# Altium schematic sheet 05_LEDs.SchDoc: ECE315 LEDs
size A; Date: 01/08/2018; ApprovedBy: JSK; CheckedBy: JSK; Author: JSK; CompanyName: University of Wisconsin; DrawnBy: JSK; Engineer: JSK; Organization: ECE 315; Address1: College of Engineering; Address2: 1415 Engineering Drive; Address3: Madison, WI 53706; Address4: ECE 315 Spring 2018; Revision: A; SheetNumber: 5; SheetTotal: 6; AssemblyNumber: ECE315-S18; ApprovedDate: ECE315-S18
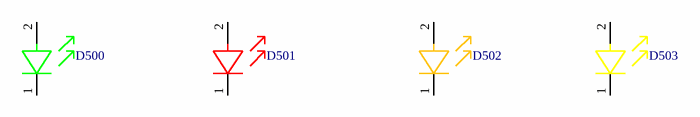
[diagram p0: 05_LEDs.SchDoc]

## Parts
D500  LED_GREEN_0805.1  [LED_GRN_0805]  (value not drawn)
D501  LED_RED_0805.1  [LED_RED_0805]  (value not drawn)
D502  LED_ORANGE.0805.1  [LED_ORG_0805]  (value not drawn)
D503  LED_YELLOW_0805.1  [LED_YEL_0805]  (value not drawn)

## Nets

Not connected (* = marked no-connect by the designer): D500 1(Cathode) 2(Anode); D501 1(Cathode) 2(Anode); D502 1(Cathode) 2(Anode); D503 1(Cathode) 2(Anode)

## Notes on the sheet
- Title:
- Size:
- A
- Machine:
- P.C. Board No:
- Assembly No:
- Rev:
- Sheet:
- of
- College of Engineering
- 1415 Engineering Drive
- Madison, WI 53706

## Library data of the parts
D500 = LED_GREEN_0805.1: LED GREEN CLEAR THIN 0805 SMD; Manufacturer: Vishay / Lite-On; Manufacturer Part Number: LTST-C171KGKT; Chip Material: AlGaInP; DELETED: Compliant; Emitting Color: Yellow Green; Forward Voltage: 2.4 V; Forward Current: 30 mA; Dominant Wave Length: 571 nm; Lum Intensity: 35mcd; High Brightness: Yes; Number of  Elements: 1; Main Category: Chip LED; Power Dissipation: 75 W; Peak Wavelength: 574 nm; Shape Type: Rectangular; Type: Uni-Color; Reverse Voltage: 5 V; Viewing Angle: 130 deg; Test Current (It): 20 mA; Rad Hardened: No; Product Depth (mm): 1.25 mm; Product Height (mm): 0.8 mm; Product Length (mm): 2 mm; Supplier 1: Digi-Key; Stock 1: 322411; Pricing 1: 1=0.31, 10=0.225, 25=0.1656, 100=0.1183, 250=0.0804, 500=0.071, 1000=0.0556 (USD); Mounting: Surface Mount; Operating Temp Range: -55C to 85C; Lens Dimensions: 1.4x1.25x0.5 mm; Luminous Intensity: 35mcd; Package Type: Chip Led; Packaging: Tape and Reel; Pin Count: 2; Operating Temperature Classification: Industrial; ComponentLink1URL: https://datasheet.ciiva.com/15118/getdatasheetpartid-214542-15118099.pdf; ComponentLink1Description: https://datasheet.ciiva.com/15118/getdatasheetpartid-214542-15118099.pdf; ComponentLink2URL: https://datasheet.ciiva.com/16200/lite-on20ltst-c171kgkt-16200100.pdf; ComponentLink2Description: https://datasheet.ciiva.com/16200/lite-on20ltst-c171kgkt-16200100.pdf; ComponentLink3URL: https://datasheet.ciiva.com/2110/s-110-ltst-c171kgkt-2110072.pdf; ComponentLink3Description: https://datasheet.ciiva.com/2110/s-110-ltst-c171kgkt-2110072.pdf; ComponentLink4URL: https://datasheet.ciiva.com/2110/s-110-ltst-c171kgkt-2110073.pdf; ComponentLink4Description: https://datasheet.ciiva.com/2110/s-110-ltst-c171kgkt-2110073.pdf; ComponentLink5URL: https://datasheet.ciiva.com/11774/0900766b80dc0298-11774377.pdf; ComponentLink5Description: https://datasheet.ciiva.com/11774/0900766b80dc0298-11774377.pdf; ComponentLink6URL: https://datasheet.ciiva.com/2110/s-110-ltst-c171kgkt-2110074.pdf; ComponentLink6Description: https://datasheet.ciiva.com/2110/s-110-ltst-c171kgkt-2110074.pdf; ComponentLink7URL: https://datasheet.ciiva.com/12400/lite-on-ltst-c171kgkt-187692-12400799.pdf; ComponentLink7Description: https://datasheet.ciiva.com/12400/lite-on-ltst-c171kgkt-187692-12400799.pdf; Supplier Part Number 1: 160-1426-1-ND
D501 = LED_RED_0805.1: LED SUPER RED CLR THIN 0805 SMD; Manufacturer: Vishay / Lite-On; Manufacturer Part Number: LTST-C171KRKT; Chip Material: AlGaInP; DELETED: Compliant; Dominant Wave Length: 631 nm; Forward Current: 30 mA; Forward Voltage: 2.4 V; High Brightness: Yes; Lum Intensity: 54mcd; Main Category: Chip LED; Number of  Elements: 1; Peak Wavelength: 639 nm; Power Dissipation: 75 W; Product Depth (mm): 1.25 mm; Product Height (mm): 0.8 mm; Product Length (mm): 2 mm; Rad Hardened: No; Reverse Voltage: 5 V; Shape Type: Rectangular; Test Current (It): 20 mA; Type: Uni-Color; Viewing Angle: 130 deg; Supplier 1: Digikey; Stock 1: 97347; Pricing 1: 1=0.31, 10=0.225, 25=0.1656, 100=0.1183, 250=0.0804, 500=0.071, 1000=0.0556 (USD); Emitting Color: Red; Lens Dimensions: 1.4x1.25x0.5 mm; Luminous Intensity: 54mcd; Mounting: Surface Mount; Operating Temp Range: -55C to 85C; Operating Temperature Classification: Industrial; Package Type: Chip Led; Packaging: Tape and Reel; Pin Count: 2; ComponentLink1URL: https://datasheet.ciiva.com/2110/s-110-ltst-c171krkt-2110066.pdf; ComponentLink1Description: https://datasheet.ciiva.com/2110/s-110-ltst-c171krkt-2110066.pdf; ComponentLink2URL: https://datasheet.ciiva.com/2110/s-110-ltst-c171krkt-2110067.pdf; ComponentLink2Description: https://datasheet.ciiva.com/2110/s-110-ltst-c171krkt-2110067.pdf; ComponentLink3URL: https://datasheet.ciiva.com/2110/s-110-ltst-c171krkt-2110068.pdf; ComponentLink3Description: https://datasheet.ciiva.com/2110/s-110-ltst-c171krkt-2110068.pdf; ComponentLink4URL: https://datasheet.ciiva.com/12403/lite-on-ltst-c171krkt-187201-12403781.pdf; ComponentLink4Description: https://datasheet.ciiva.com/12403/lite-on-ltst-c171krkt-187201-12403781.pdf; ComponentLink5URL: https://datasheet.ciiva.com/11775/0900766b80dc0299-11775643.pdf; ComponentLink5Description: https://datasheet.ciiva.com/11775/0900766b80dc0299-11775643.pdf; ComponentLink6URL: https://datasheet.ciiva.com/16444/lite-on20ltst-c171krkt-16444779.pdf; ComponentLink6Description: https://datasheet.ciiva.com/16444/lite-on20ltst-c171krkt-16444779.pdf; Supplier Part Number 1: 160-1427-1-ND
D502 = LED_ORANGE.0805.1: LED ORANGE DIFFUSED 0805 SMD; Manufacturer: Rohm; Manufacturer Part Number: SML-210DTT86; Intensity: 6.3 mcd; Lens Type: Clear; Forward (Drive) Current: 25 mA; Forward Voltage: 2 V; Viewing Angle: 130 °; Supplier 1: Digikey; Stock 1: 28453; Pricing 1: 1=0.39, 10=0.277, 25=0.2404, 100=0.1848, 250=0.1502, 500=0.1109, 1000=0.0924 (USD); Color: Orange; Dimension: 2 x 1.25 x 0.8 mm; ComponentLink1URL: https://datasheet.ciiva.com/2110/sml-21-2110727.pdf; ComponentLink1Description: https://datasheet.ciiva.com/2110/sml-21-2110727.pdf; ComponentLink2URL: https://datasheet.ciiva.com/2110/sml-21-2110728.pdf; ComponentLink2Description: https://datasheet.ciiva.com/2110/sml-21-2110728.pdf; ComponentLink3URL: https://datasheet.ciiva.com/2110/sml-21-2110729.pdf; ComponentLink3Description: https://datasheet.ciiva.com/2110/sml-21-2110729.pdf; ComponentLink4URL: https://datasheet.ciiva.com/11773/0900766b80df3a40-11773931.pdf; ComponentLink4Description: https://datasheet.ciiva.com/11773/0900766b80df3a40-11773931.pdf; ComponentLink5URL: https://datasheet.ciiva.com/16488/sml-210ltt86-16488028.pdf; ComponentLink5Description: https://datasheet.ciiva.com/16488/sml-210ltt86-16488028.pdf; Supplier Part Number 1: 511-1284-1-ND
D503 = LED_YELLOW_0805.1: LED YELLOW CLEAR THIN 0805 SMD; Manufacturer: Vishay / Lite-On; Manufacturer Part Number: LTST-C171KSKT; Chip Material: AlGaInP; DELETED: Compliant; Emitting Color: Amber; Forward Voltage: 2.4 V; Forward Current: 30 mA; Dominant Wave Length: 587 nm; Lum Intensity: 50mcd; High Brightness: Yes; Number of  Elements: 1; Main Category: Chip LED; Power Dissipation: 75 W; Peak Wavelength: 588 nm; Shape Type: Rectangular; Type: Uni-Color; Reverse Voltage: 5 V; Viewing Angle: 130 deg; Test Current (It): 20 mA; Rad Hardened: No; Product Depth (mm): 1.25 mm; Product Height (mm): 0.8 mm; Product Length (mm): 2 mm; Supplier 1: Digikey; Stock 1: 18113; Pricing 1: 1=0.33, 10=0.239, 25=0.1764, 100=0.126, 250=0.0856, 500=0.0756, 1000=0.0592 (USD); Mounting: Surface Mount; Operating Temp Range: -55C to 85C; Lens Dimensions: 1.4x1.25x0.5 mm; Luminous Intensity: 50mcd; Package Type: Chip Led; Packaging: Tape and Reel; Pin Count: 2; Operating Temperature Classification: Industrial; ComponentLink1URL: https://datasheet.ciiva.com/15118/getdatasheetpartid-233685-15118145.pdf; ComponentLink1Description: https://datasheet.ciiva.com/15118/getdatasheetpartid-233685-15118145.pdf; ComponentLink2URL: https://datasheet.ciiva.com/2110/s-110-ltst-c171kskt-2110147.pdf; ComponentLink2Description: https://datasheet.ciiva.com/2110/s-110-ltst-c171kskt-2110147.pdf; ComponentLink3URL: https://datasheet.ciiva.com/2110/s-110-ltst-c171kskt-2110148.pdf; ComponentLink3Description: https://datasheet.ciiva.com/2110/s-110-ltst-c171kskt-2110148.pdf; ComponentLink4URL: https://datasheet.ciiva.com/19466/2075639-19466196.pdf; ComponentLink4Description: https://datasheet.ciiva.com/19466/2075639-19466196.pdf; ComponentLink5URL: https://datasheet.ciiva.com/2110/s-110-ltst-c171kskt-2110149.pdf; ComponentLink5Description: https://datasheet.ciiva.com/2110/s-110-ltst-c171kskt-2110149.pdf; ComponentLink6URL: https://datasheet.ciiva.com/16200/lite-on20ltst-c171kskt-16200102.pdf; ComponentLink6Description: https://datasheet.ciiva.com/16200/lite-on20ltst-c171kskt-16200102.pdf; ComponentLink7URL: https://datasheet.ciiva.com/12403/lite-on-ltst-c171kskt-190118-12403721.pdf; ComponentLink7Description: https://datasheet.ciiva.com/12403/lite-on-ltst-c171kskt-190118-12403721.pdf; ComponentLink8URL: https://datasheet.ciiva.com/11774/0900766b80dc029a-11774587.pdf; ComponentLink8Description: https://datasheet.ciiva.com/11774/0900766b80dc029a-11774587.pdf; Supplier Part Number 1: 160-1428-1-ND